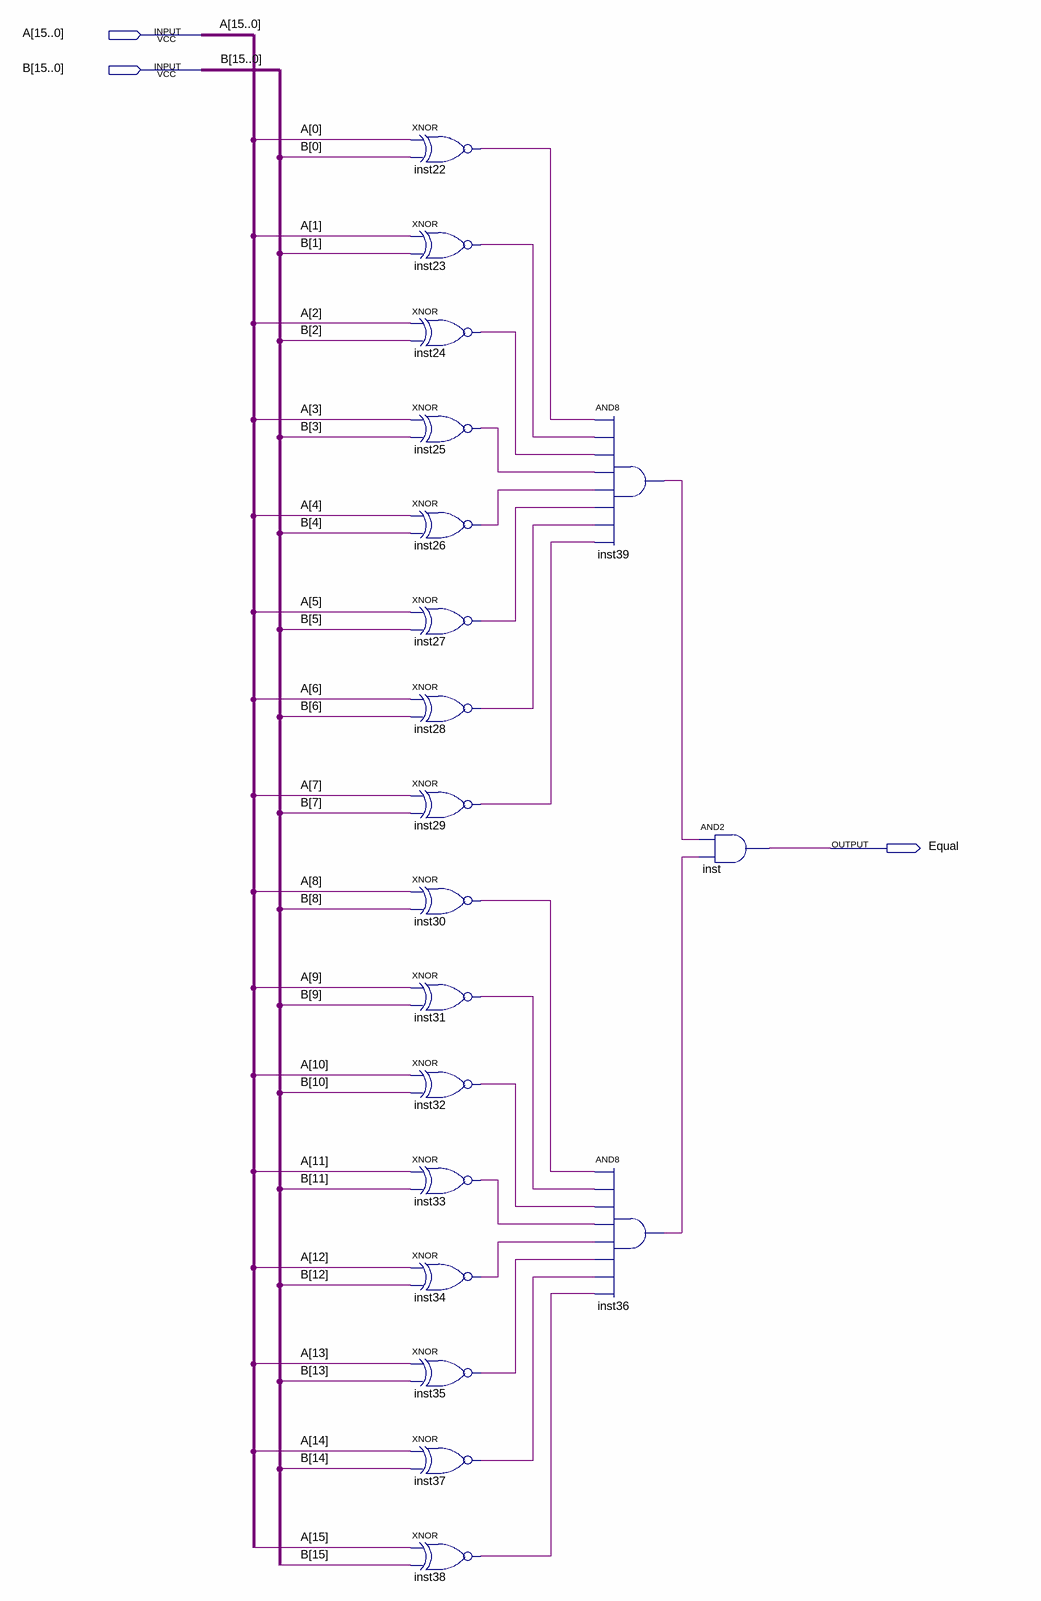
[diagram p0: schematic sheet]
// Quartus schematic Equal_16bit.bdf as structural Verilog: 19 symbols, 3 pins
module Equal_16bit (
  input  [15:0] A,
  input  [15:0] B,
  output Equal
);

  wire inst22_out, inst23_out, inst24_out, inst25_out, inst26_out, inst27_out, inst28_out, inst29_out,
       inst30_out, inst31_out, inst32_out, inst33_out, inst34_out, inst35_out, inst36_out, inst37_out,
       inst38_out, inst39_out;

  xnor inst22 (inst22_out, A[0], B[0]);
  xnor inst23 (inst23_out, A[1], B[1]);
  xnor inst24 (inst24_out, A[2], B[2]);
  xnor inst25 (inst25_out, A[3], B[3]);
  xnor inst26 (inst26_out, A[4], B[4]);
  xnor inst27 (inst27_out, A[5], B[5]);
  xnor inst28 (inst28_out, A[6], B[6]);
  xnor inst29 (inst29_out, A[7], B[7]);
  xnor inst30 (inst30_out, A[8], B[8]);
  xnor inst31 (inst31_out, A[9], B[9]);
  xnor inst32 (inst32_out, A[10], B[10]);
  xnor inst33 (inst33_out, A[11], B[11]);
  xnor inst34 (inst34_out, A[12], B[12]);
  xnor inst35 (inst35_out, A[13], B[13]);
  xnor inst37 (inst37_out, A[14], B[14]);
  xnor inst38 (inst38_out, A[15], B[15]);
  and inst39 (inst39_out, inst22_out, inst23_out, inst24_out, inst25_out, inst26_out, inst27_out, inst28_out, inst29_out);
  and inst36 (inst36_out, inst30_out, inst31_out, inst32_out, inst33_out, inst34_out, inst35_out, inst37_out, inst38_out);
  and inst (Equal, inst39_out, inst36_out);
endmodule
